# EAGLE design toucanRev2 (EAGLE 9.1.3)
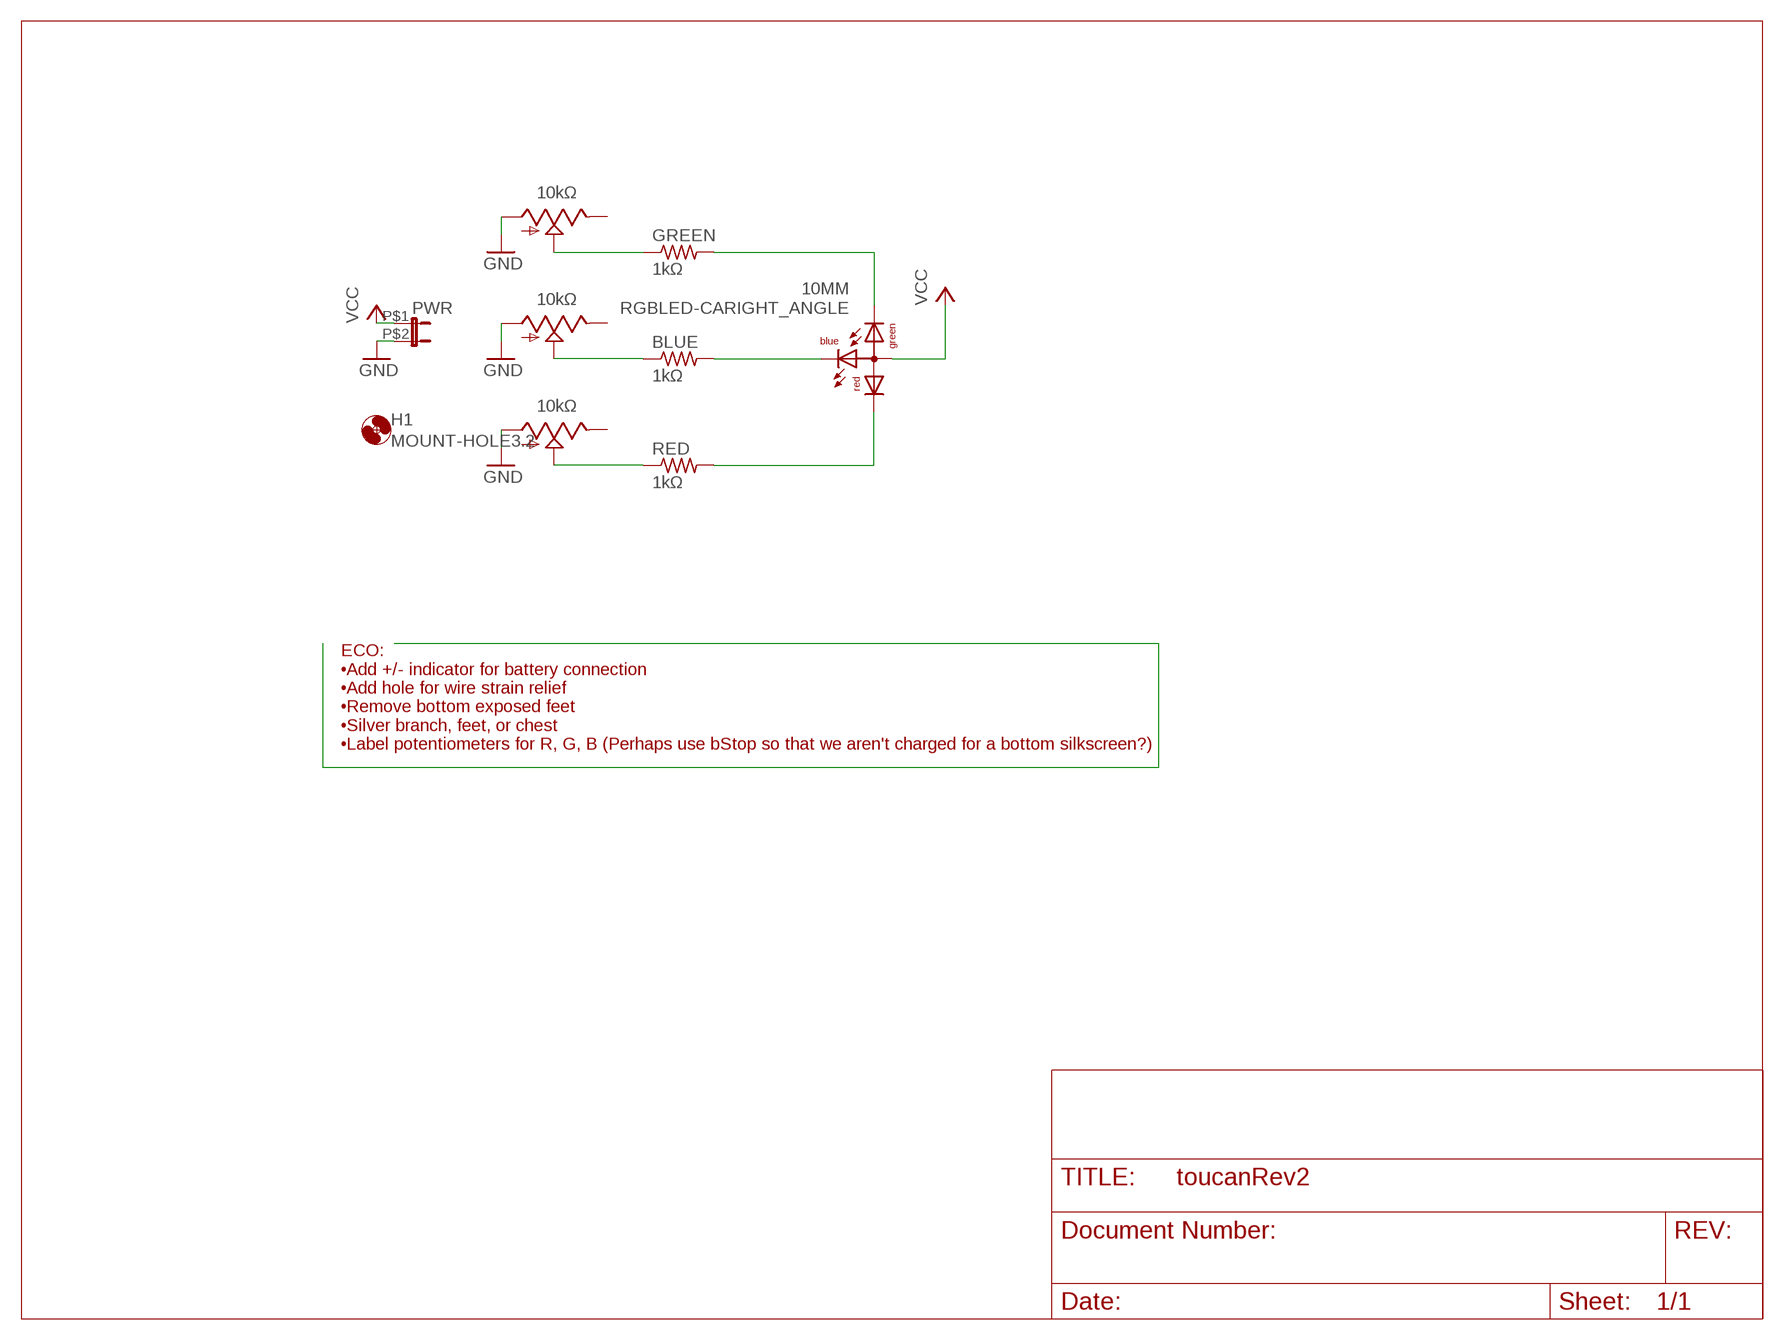
[diagram p0: schematic, sheet 1]

## Parts
10MM  RGBLED-CARIGHT_ANGLE  [RGB10MM_FLAT]
BLUE  1kΩ  RESISTOR  [0207/12]
GREEN  1kΩ  RESISTOR  [0207/12]
H1  MOUNT-HOLE3.2  [3,2]
PWR  2POS_HEADERJUMPER  [2HEADER]
RED  1kΩ  RESISTOR  [0207/12]
U$2  10kΩ  POTBOURNS  [S63P]
U$4  10kΩ  POTBOURNS  [S63P]
U$5  10kΩ  POTBOURNS  [S63P]

## Nets
BLUE_2_LED: 10MM.PIN4(AB_PIN4) BLUE.2
BLUE_2_POT: BLUE.1 U$4.CENTER(S)
GND: PWR.P$2 U$2.LEFT(A) U$4.LEFT(A) U$5.LEFT(A)
GREEN_2_LED: 10MM.PIN3(AG_PIN3) GREEN.2
GREEN_2_POT: GREEN.1 U$2.CENTER(S)
RED_2_LED: 10MM.PIN1(AR_PIN1) RED.2
RED_2_POT: RED.1 U$5.CENTER(S)
VCC: 10MM.PIN2(C_PIN2) PWR.P$1
Unconnected: U$2.RIGHT(E) U$4.RIGHT(E) U$5.RIGHT(E)

## Notes on the sheet
- ECO:
  •Add +/- indicator for battery connection
  •Add hole for wire strain relief
  •Remove bottom exposed feet
  •Silver branch, feet, or chest
  •Label potentiometers for R, G, B (Perhaps use bStop so that we aren't charged for a bottom silkscreen?)

## Library data of the parts
10MM = toucanLib:RGBLED-CA
BLUE GREEN RED = coulston:RESISTOR
H1 = holes:MOUNT-HOLE: MOUNTING HOLE with drill center marker
PWR = coulston:2POS_HEADER
U$2 U$4 U$5 = coulston:POT

## Board
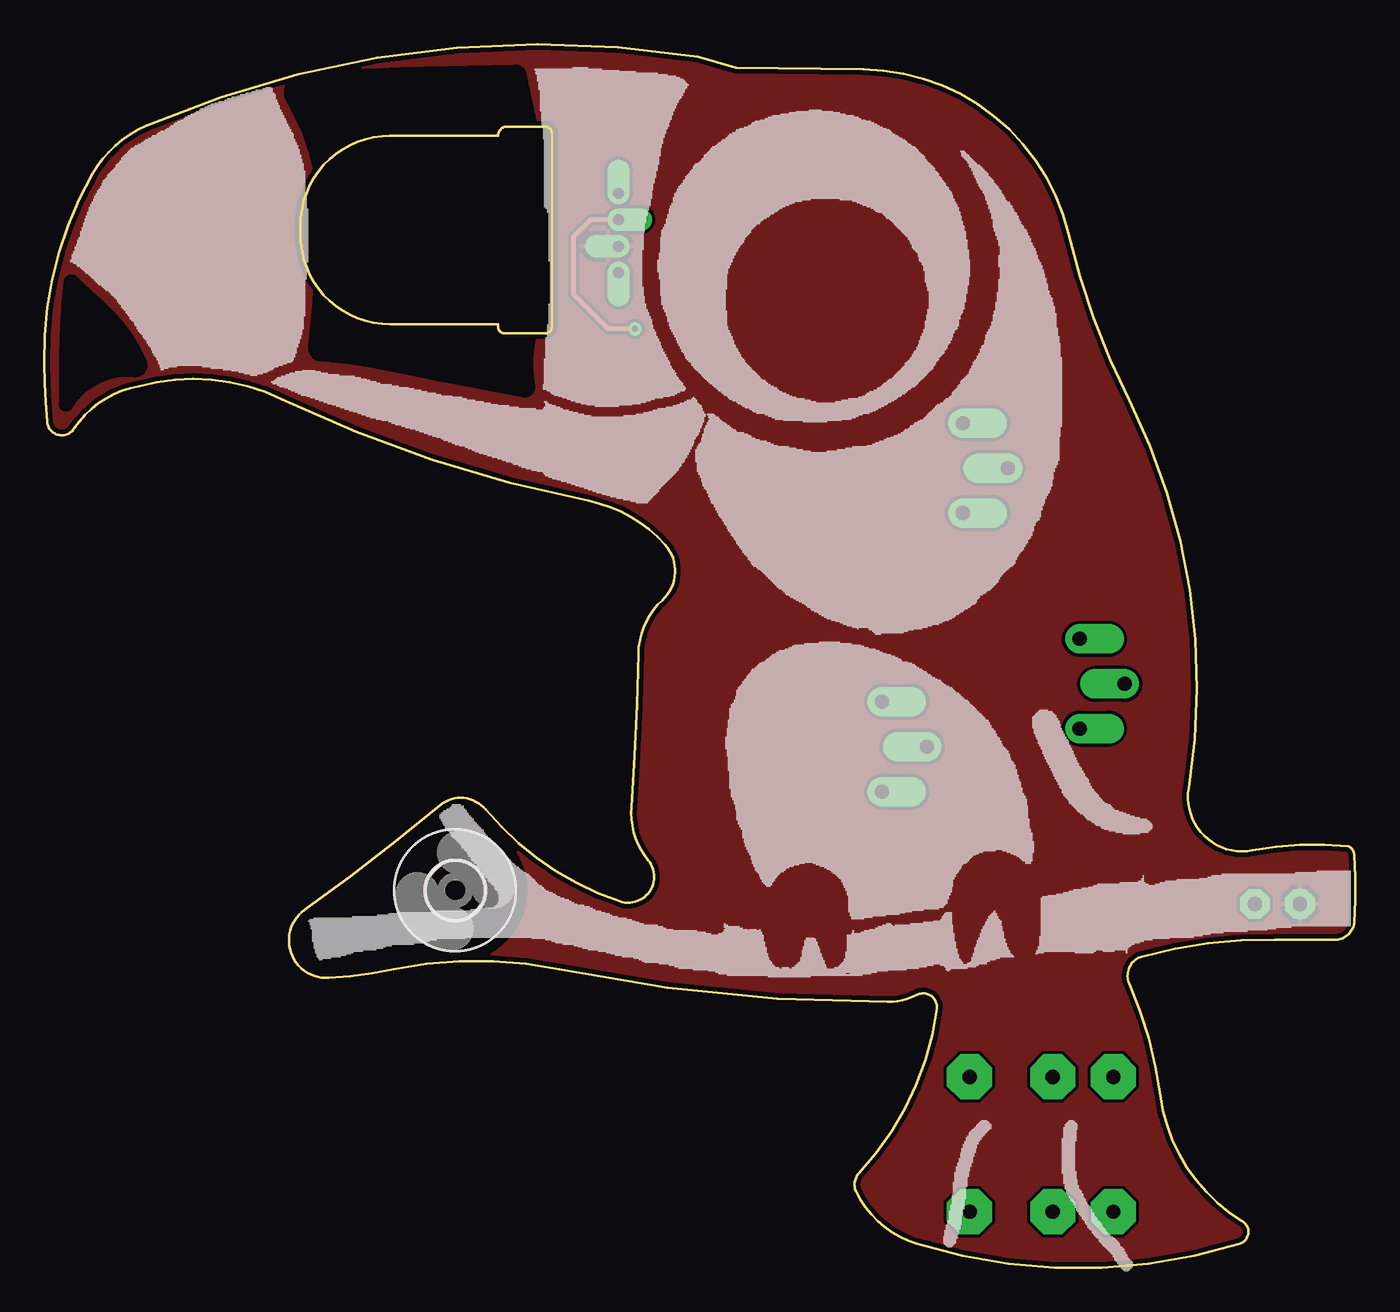
[diagram p1: board, top side]
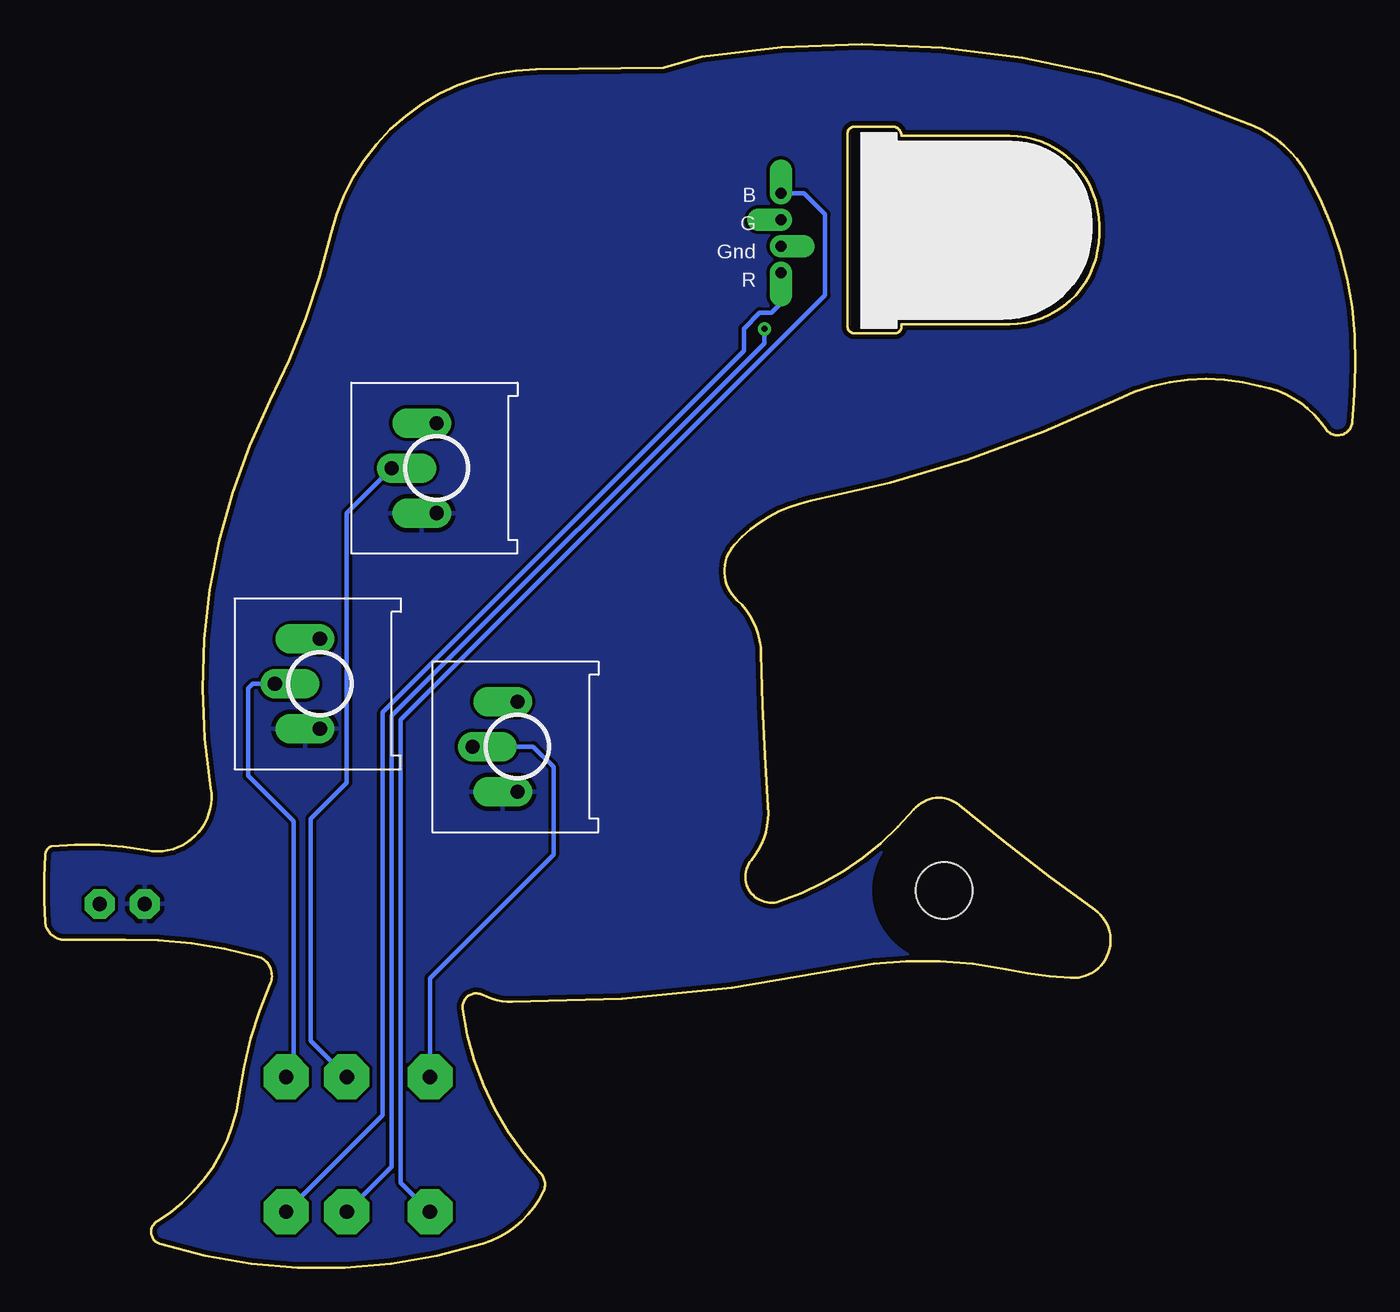
[diagram p2: board, bottom side, seen from below]

Size 74.14 x 69.16 mm. Coordinates in mm from the lower left corner, seen from the top.
Outline: 0,51.1 arc-31 2.72,61.82 arc-37 5.76,64.54 arc-32 36.96,68.46 39.12,67.82 46.32,67.74 arc-76 57.92,58.46 arc13 61.36,49.02 arc-36 64.72,27.1 arc110 68.32,23.58 arc-16 73.76,23.82 arc-59 74.08,23.34 arc-9 74.08,19.5 arc-19 74,19.18 arc-65 73.04,18.54 arc-2 69.6,18.54 arc17 62.08,17.58 arc98 61.36,16.06 arc-16 63.12,9.74 arc51 67.76,2.62 arc-132 67.6,1.34 arc-34 49.36,1.34 arc-47 45.92,4.3 arc-69 46.08,5.34 arc35 50.48,14.62 arc124 49.36,15.42 arc-26 47.68,15.02 arc-12 29.12,16.86 arc23 19.76,16.86 arc-8 16.08,16.38 arc-148 14.72,20.22 arc4 22.4,26.14 arc-90 24.96,25.9 arc32 32.56,20.7 arc148 34.16,23.02 arc-44 33.2,26.06 arc3 33.6,34.7 arc-46 34.96,37.74 arc88 35.12,40.86 arc38 30.8,43.34 arc-15 13.44,49.1 arc41 5.36,49.82 arc46 1.68,47.42 arc-142 0.16,47.82 arc-3 0,51.1
Outline: 25.66,63.99 19.57,63.99 arc90 14.49,58.91 14.49,58.4 arc90 19.57,53.32 25.66,53.32 25.66,53.19 arc90 26.04,52.81 28.33,52.81 arc90 28.71,53.19 28.71,64.12 arc90 28.33,64.5 26.17,64.5 arc90 25.66,63.99
Copper layers (1*16): Top 0.0356mm / dielectric 1.5011mm / Bottom 0.0356mm
Design rules "PCBway": minimum track width 7mil, minimum drill 10mil, track to track 7mil, track to pad 7mil, pad to pad 7mil, via to via 7mil, smd to smd 0mil, copper to edge 10mil, drill to drill 10mil, minimum pad ring 4mil, minimum via ring 8mil, stop-mask expansion 4mil, vias tented up to drill 0mil, thermal gap 10mil
tRestrict: area 0.9,48.5 to 5.8,56.1; area 13.6,49.2 to 28.3,67.9
Milling: area 14.5,52.8 to 28.7,64.5

### Footprints (pad centres in the part's own frame; a part is rotated, then mirrored left to right if it is on the bottom)
RGB10MM_FLAT = drill 0.61 pad 1.27 offset: PIN1 -2.4,0; PIN2 -0.9,0; PIN3 0.6,0; PIN4 2.1,0
0207/12 = drill 0.813 pad 2.54 octagon: 1 -3.81,0; 2 3.81,0
3,2 = hole 3.2: 0,0
2HEADER = drill 0.8 pad 1.676 octagon: P$1 -1.27,0; P$2 1.27,0
S63P = drill 0.8 pad 1.676 offset: CENTER 0,-2.54; LEFT 2.54,0; RIGHT -2.54,0

### Placement (x,y rotation side)
10MM  32.48,58.64 90 bottom
BLUE  52.33,6.97 270 bottom
GREEN  57.03,6.97 270 bottom
H1  23.25,21.32 0 top
PWR  69.73,20.56 180 top
RED  60.46,6.97 270 bottom
U$2  51.95,45.19 270 bottom
U$4  47.38,29.45 270 bottom
U$5  58.56,33 270 bottom

### Tracks (layer width: path | path; a pad name or v marks a point on that pad's centre or on a via)
BLUE_2_LED
  Bottom 0.254: BLUE.2 53.98,4.81 53.98,30.97 29.98,54.97 29.98,59.54 31.17,60.74 10MM.PIN4
BLUE_2_POT
  Bottom 0.254: U$4.CENTER 46.49,29.45 45.35,28.3 45.35,23.35 52.33,16.36 BLUE.1
GND
  pour Bottom: 36.96,68.46 arc32 5.76,64.54 arc37 2.72,61.82 arc31 0,51.1 arc3 0.16,47.82 arc142 1.68,47.42 arc-46 5.36,49.82 arc-41 13.44,49.1 arc15 30.8,43.34 arc-38 35.12,40.86 arc-88 34.96,37.74 arc46 33.6,34.7 arc-3 33.2,26.06 arc44 34.16,23.02 arc-148 32.56,20.7 arc-32 24.96,25.9 arc90 22.4,26.14 arc-4 14.72,20.22 arc148 16.08,16.38 arc8 19.76,16.86 arc-23 29.12,16.86 arc12 47.68,15.02 arc26 49.36,15.42 arc-124 50.48,14.62 arc-35 46.08,5.34 arc69 45.92,4.3 arc47 49.36,1.34 arc34 67.6,1.34 arc132 67.76,2.62 arc-51 63.12,9.74 arc16 61.36,16.06 arc-98 62.08,17.58 arc-17 69.6,18.54 arc2 73.04,18.54 arc65 74,19.18 arc19 74.08,19.5 arc9 74.08,23.34 arc59 73.76,23.82 arc16 68.32,23.58 arc-110 64.72,27.1 arc36 61.36,49.02 arc-13 57.92,58.46 arc76 46.32,67.74 39.12,67.82
GREEN_2_LED  (via drill 0.35)
  Top 0.254: 10MM.PIN3 30.91,59.24 29.93,58.26 29.93,55.02 31.89,53.07 v33.41,53.07
  Bottom 0.254: GREEN.2 54.49,5.7 54.49,31.18 33.41,52.26 v33.41,53.07
GREEN_2_POT
  Bottom 0.254: GREEN.1 59.06,12.81 59.06,25.38 57.03,27.41 57.03,42.65 U$2.CENTER
RED_2_LED
  Bottom 0.254: RED.2 55,8.62 55,31.39 34.58,51.81 34.58,53.09 33.68,53.98 33.01,53.98 32.48,54.51 10MM.PIN1
RED_2_POT
  Bottom 0.254: RED.1 60.05,11.19 60.05,25.22 62.62,27.79 62.62,32.75 62.37,33 U$5.CENTER
VCC
  pour Top: 36.96,68.46 arc32 5.76,64.54 arc37 2.72,61.82 arc31 0,51.1 arc3 0.16,47.82 arc142 1.68,47.42 arc-46 5.36,49.82 arc-41 13.44,49.1 arc15 30.8,43.34 arc-38 35.12,40.86 arc-88 34.96,37.74 arc46 33.6,34.7 arc-3 33.2,26.06 arc44 34.16,23.02 arc-148 32.56,20.7 arc-32 24.96,25.9 arc90 22.4,26.14 arc-4 14.72,20.22 arc148 16.08,16.38 arc8 19.76,16.86 arc-23 29.12,16.86 arc12 47.68,15.02 arc26 49.36,15.42 arc-124 50.48,14.62 arc-35 46.08,5.34 arc69 45.92,4.3 arc47 49.36,1.34 arc34 67.6,1.34 arc132 67.76,2.62 arc-51 63.12,9.74 arc16 61.36,16.06 arc-98 62.08,17.58 arc-17 69.6,18.54 arc2 73.04,18.54 arc65 74,19.18 arc19 74.08,19.5 arc9 74.08,23.34 arc59 73.76,23.82 arc16 68.32,23.58 arc-110 64.72,27.1 arc36 61.36,49.02 arc-13 57.92,58.46 arc76 46.32,67.74 39.12,67.82

### Text on the board
bStop: Long | Green | Red | Blue | Red | Black